# Altium schematic sheet 5  - Status Lights.SchDoc
size 406 x 304 mm
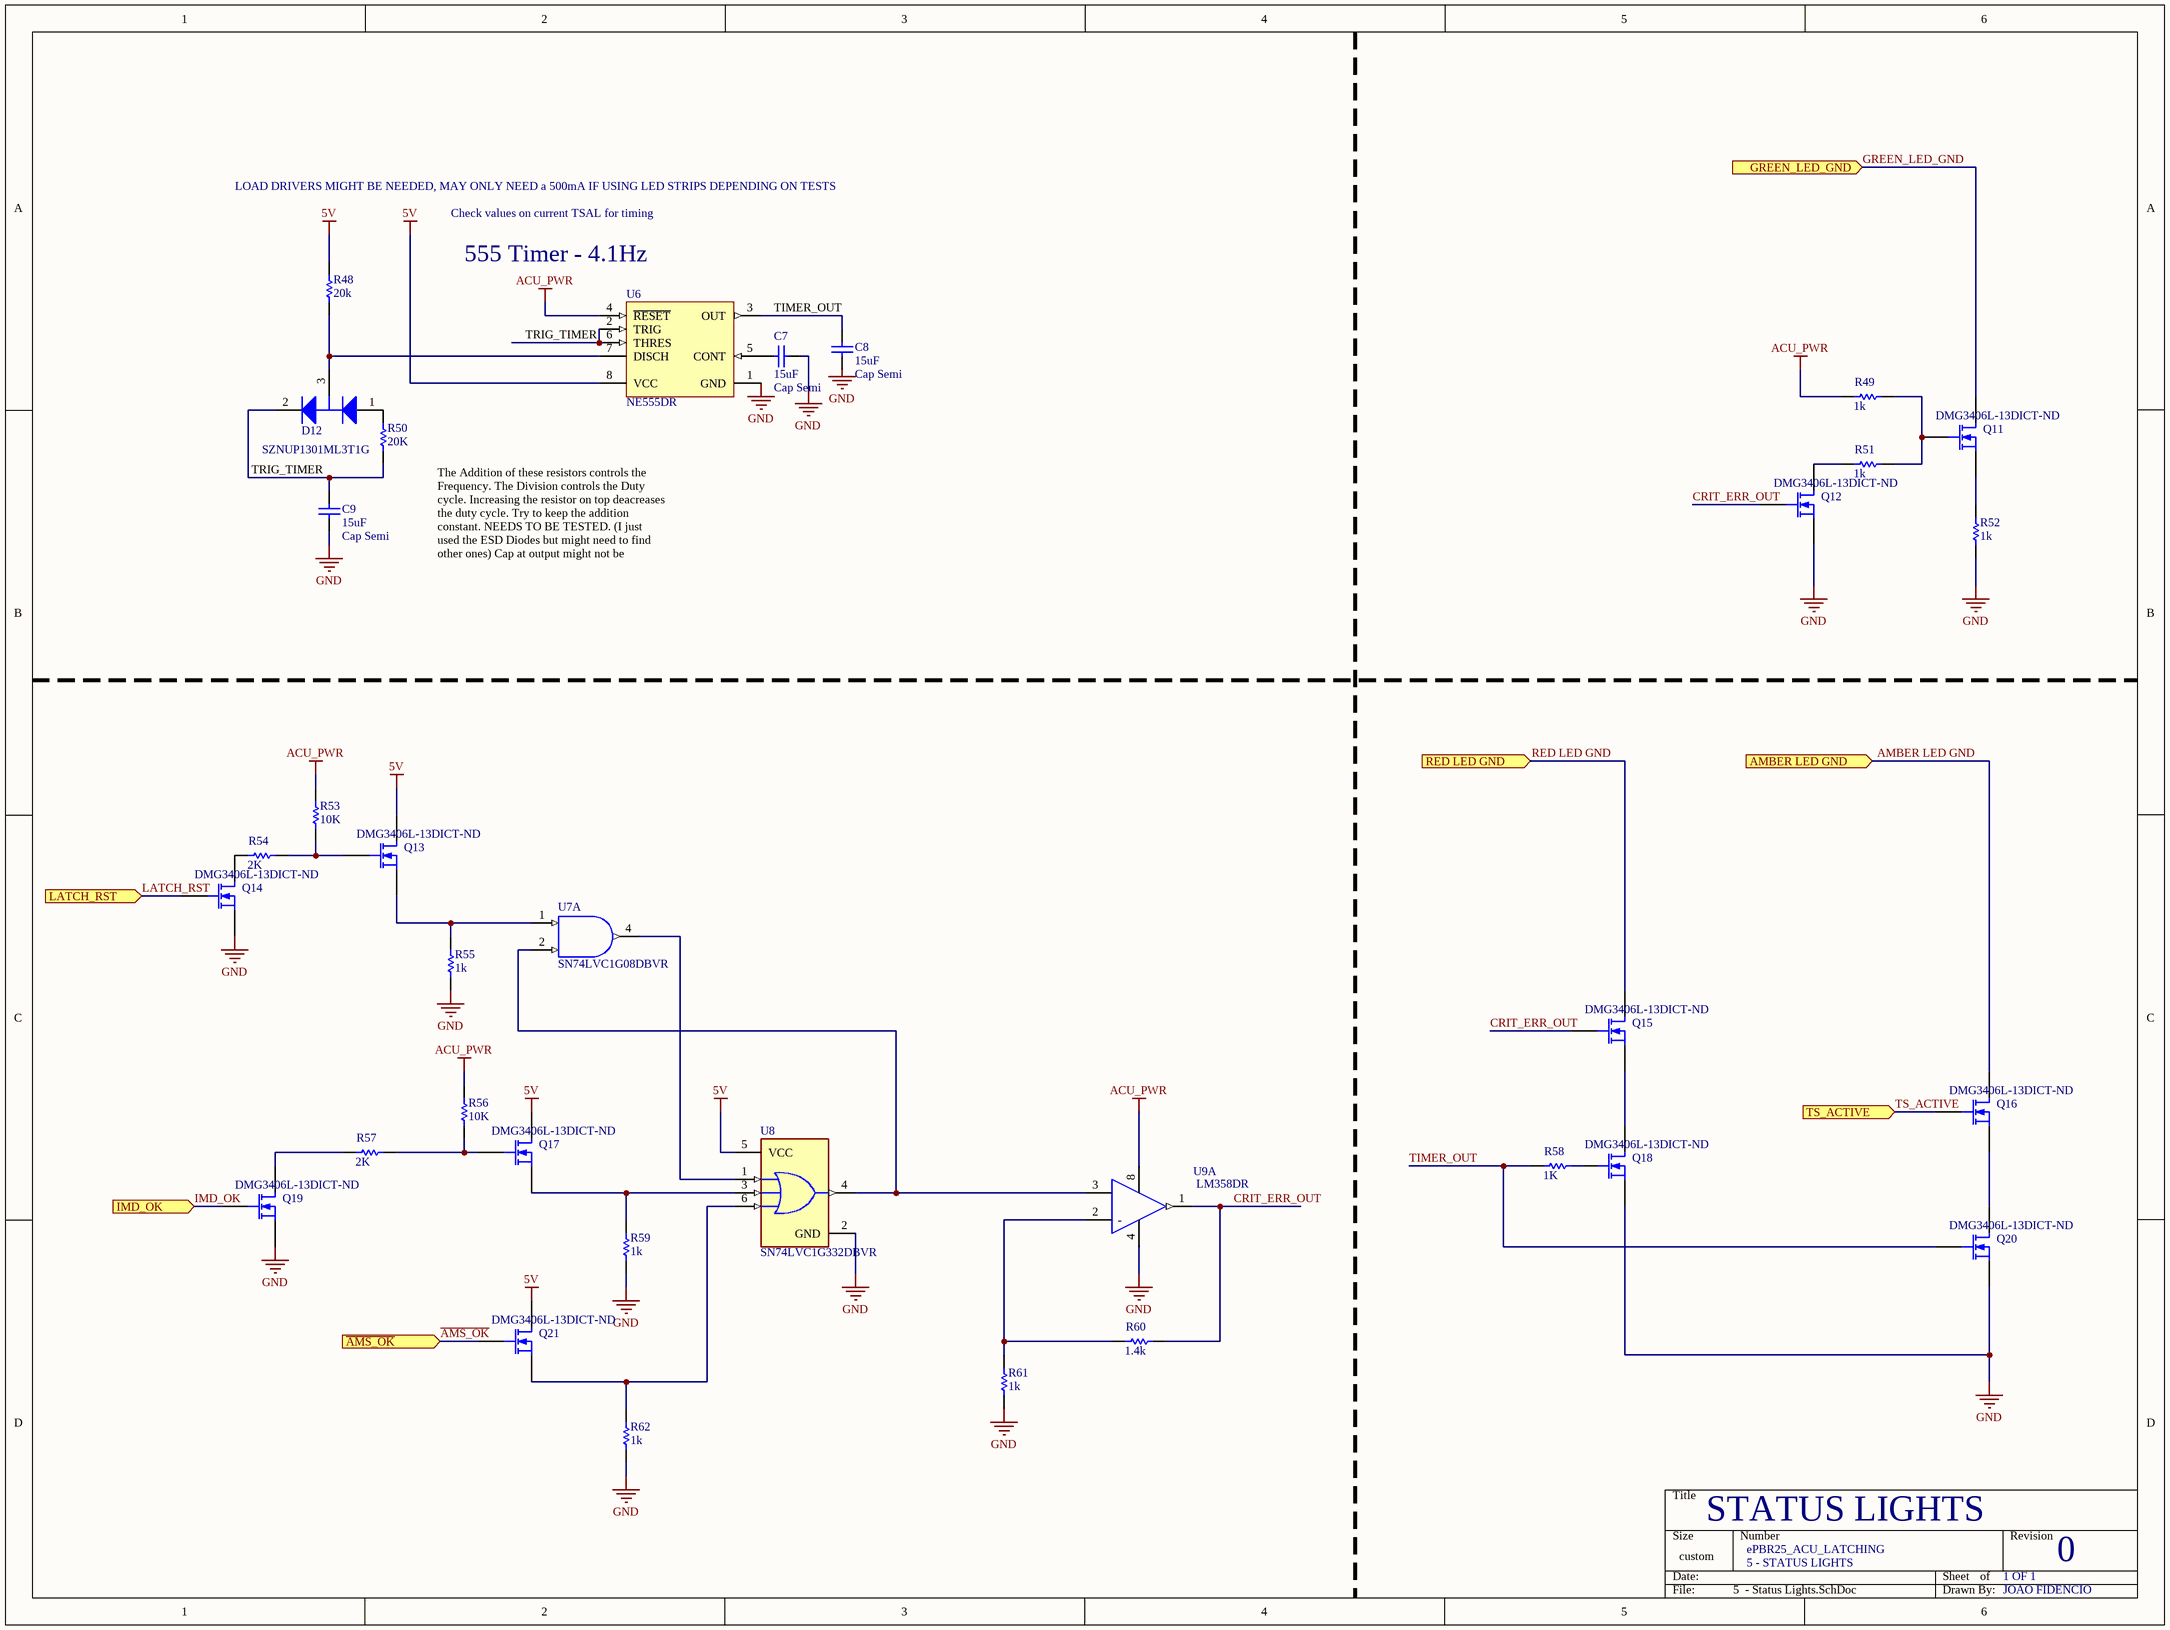
[diagram p0: 5  - Status Lights.SchDoc]

## Parts
C7  Cap Semi  value 15uF  [1608[0603]]
C8  Cap Semi  value 15uF  [1608[0603]]
C9  Cap Semi  value 15uF  [1608[0603]]
D12  SZNUP1301ML3T1G  [ONSC-SOT-23-3-318-08_V]
Q11  Supplier Part Number 1: DMG3406L-13DICT-ND  [SOT23-GDS]
Q12  Supplier Part Number 1: DMG3406L-13DICT-ND  [SOT23-GDS]
Q13  Supplier Part Number 1: DMG3406L-13DICT-ND  [SOT23-GDS]
Q14  Supplier Part Number 1: DMG3406L-13DICT-ND  [SOT23-GDS]
Q15  Supplier Part Number 1: DMG3406L-13DICT-ND  [SOT23-GDS]
Q16  Supplier Part Number 1: DMG3406L-13DICT-ND  [SOT23-GDS]
Q17  Supplier Part Number 1: DMG3406L-13DICT-ND  [SOT23-GDS]
Q18  Supplier Part Number 1: DMG3406L-13DICT-ND  [SOT23-GDS]
Q19  Supplier Part Number 1: DMG3406L-13DICT-ND  [SOT23-GDS]
Q20  Supplier Part Number 1: DMG3406L-13DICT-ND  [SOT23-GDS]
Q21  Supplier Part Number 1: DMG3406L-13DICT-ND  [SOT23-GDS]
R48  20k  [RESC0603(1608)_L]
R49  1k  [RESC0603(1608)_L]
R50  20K  [RESC0603(1608)_L]
R51  1k  [RESC0603(1608)_L]
R52  1k  [RESC0603(1608)_L]
R53  10K  [RESC0603(1608)_L]
R54  2K  [RESC0603(1608)_L]
R55  1k  [RESC0603(1608)_L]
R56  10K  [RESC0603(1608)_L]
R57  2K  [RESC0603(1608)_L]
R58  1K  [RESC0603(1608)_L]
R59  1k  [RESC0603(1608)_L]
R60  1.4k  [RESC0603(1608)_L]
R61  1k  [RESC0603(1608)_L]
R62  1k  [RESC0603(1608)_L]
U6  NE555DR  [D0008A_M]
U7  SN74LVC1G08DBVR  [DBV0005A_M]  (part A of 2)
U8  SN74LVC1G332DBVR  [FP-DBV0006A-MFG]
U9  LM358DR  [FP-D0008A-MFG]  (part A of 2)

## Ports
AMBER LED GND (in), GREEN_LED_GND (in), IMD_OK (in), LATCH_RST (in), RED LED GND (in), TS_ACTIVE (in), ~{AMS_OK} (in)

## Nets
5V: Q13.3(D) Q17.3(D) Q21.3(D) R48.1 U6.8(VCC) U8.5(VCC)
ACU_PWR: R49.1 R53.2 R56.2 U6.4(~{RESET}) U9.8(V+)
GND: C7.1 C9.2 Q12.2(S) Q14.2(S) Q18.2(S) Q19.2(S) Q20.2(S) R52.1 R55.2 R59.2 R61.2 R62.2 U6.1(GND) U8.2(GND) U9.4(V-)
~{AMS_OK}: Q21.1(G) ; port ~{AMS_OK}
AMBER LED GND: Q16.3(D) ; port AMBER LED GND
CRIT_ERR_OUT: Q12.1(G) Q15.1(G) R60.2 U9.1(1OUT)
GREEN_LED_GND: Q11.3(D) ; port GREEN_LED_GND
IMD_OK: Q19.1(G) ; port IMD_OK
LATCH_RST: Q14.1(G) ; port LATCH_RST
RED LED GND: Q15.3(D) ; port RED LED GND
TIMER_OUT: C8.1 Q20.1(G) R58.1 U6.3(OUT)
TRIG_TIMER: C9.1 D12.2(K) R50.1 U6.2(TRIG) U6.6(THRES)
TS_ACTIVE: Q16.1(G) ; port TS_ACTIVE
NetC7_2: C7.2 U6.5(CONT)
NetD12_1: D12.1(A) R50.2
NetD12_3: D12.3(K/A) R48.2 U6.7(DISCH)
NetQ11_1: Q11.1(G) R49.2 R51.2
NetQ11_2: Q11.2(S) R52.2
NetQ12_3: Q12.3(D) R51.1
NetQ13_1: Q13.1(G) R53.1 R54.2
NetQ13_2: Q13.2(S) R55.1 U7.1(A)
NetQ14_3: Q14.3(D) R54.1
NetQ15_2: Q15.2(S) Q18.3(D)
NetQ16_2: Q16.2(S) Q20.3(D)
NetQ17_1: Q17.1(G) R56.1 R57.2
NetQ17_2: Q17.2(S) R59.1 U8.3(B)
NetQ18_1: Q18.1(G) R58.2
NetQ19_3: Q19.3(D) R57.1
NetQ21_2: Q21.2(S) R62.1 U8.6(C)
NetR60_1: R60.1 R61.1 U9.2(IN1-)
NetU7_2: U7.2(B) U8.4(Y) U9.3(IN1+)
NetU7_4: U7.4(Y) U8.1(A)

Not connected (* = marked no-connect by the designer): C8 2

## Notes on the sheet
- LOAD DRIVERS MIGHT BE NEEDED, MAY ONLY NEED a 500mA IF USING LED STRIPS DEPENDING ON TESTS
- Check values on current TSAL for timing
- (near U6) 555 Timer - 4.1Hz
- The Addition of these resistors controls the Frequency. The Division controls the Duty cycle. Increasing the resistor on top deacreases the duty cycle. Try to keep the addition constant. NEEDS TO BE TESTED. (I just used the ESD Diodes but might need to find other ones) Cap at output might not be needed? Cap from 12V to GND might be needed.
- STATUS LIGHTS
- ePBR25_ACU_LATCHING
- 5 - STATUS LIGHTS
- 1 OF 1
- 0
- JOAO FIDENCIO
- Labels drawn without touching a wire or pin: GND
- (in symbol CMP-1685-00009-2, part A) -

## Library data of the parts
C7-C9 = Cap Semi: Capacitor (Semiconductor SIM Model); Published: 8-Jun-2000; LatestRevisionDate: 29-May-2009; LatestRevisionNote: IPC-7351 Footprint Added.; PackageReference: C1206; Publisher: Altium Limited; PackageDescription: Chip Capacitor
D12 = CMP-1063-00171-1: Low Capacitance Diode Array for ESD Protection in a Single Data Line, 3-Pin SOT-23, Pb-Free, Tape and Reel; Manufacturer: On Semiconductor; C Max (pF): 0.9; Direction: Bidirectional; V(BR) Min (V): 70; Number of Lines: 1; Mounting Technology: Surface Mount; PackageReference: SOT-23-3-318-08; DatasheetVersion: Rev. 6; PackageVersion: Rev. AP, 11/2009; RoHS: Pb-Free; ComponentLink1Description: Manufacturer URL; ComponentLink1URL: http://www.onsemi.com/; PackageDescription: 3-Pin Small Outline Transistor, Body 2.92 x 1.3 mm, Pitch 0.95 mm; PartNumber: SZNUP1301ML3T1G; Packing: Tape and Reel; ComponentLink3URL: http://www.onsemi.cn/pub_link/Collateral/318-08.PDF; ComponentLink3Description: Package Specification; VRWM Max (V): 70; ComponentLink2Description: Datasheet; ComponentLink2URL: http://www.onsemi.cn/pub_link/Collateral/NUP1301ML3T1-D.PDF; Supplier 1: Digi-Key; Supplier Part Number 1: SZNUP1301ML3T1GOSCT-ND
Q11-Q21 = MOSFET-N: N-Channel MOSFET; Manufacturer: Infineon Technologies; FET Type: MOSFET N-Channel, Metal Oxide; FET Feature: Logic Level Gate; Drain to Source Voltage (Vdss): 30V; Current - Continuous Drain (Id) @ 25°C: 50A (Tc); Rds On (Max) @ Id, Vgs: 7.5 mOhm @ 30A, 10V; Vgs(th) (Max) @ Id: 2.2V @ 250µA; Gate Charge (Qg) @ Vgs: 18nC @ 10V; Input Capacitance (Ciss) @ Vds: 1900pF @ 15V; Power - Max: 47W; Published: 8-Jun-2000; LatestRevisionDate: 17-Jul-2002; LatestRevisionNote: Re-released for DXP Platform.; PackageVersion: 1995/1996; PackageReference: E3; Publisher: Altium Limited; PackageDescription: TO, Flat Index; 3 In-Line, Axial Leads; Body Dia. 4.6mm; Lead Dia. 0.5 mm (max); RoHS: RoHS Compliant; Category: Discrete Semiconductor Products; Packaging: Cut Tape (CT); Mounting Type: Surface Mount; Package / Case: TO-252-3, DPak (2 Leads + Tab), SC-63; Supplier Device Package: PG-TO252-3; ComponentLink1URL: http://www.infineon.com/dgdl/Infineon-IPD075N03LG-DS-v02_01-en.pdf?folderId=5546d4694909da4801490a07012f053b&fileId=db3a30431936bc4b011951d824f83aeb; ComponentLink1Description: http://www.infineon.com/dgdl/Infineon-IPD075N03LG-DS-v02_01-en.pdf?folderId=5546d4694909da4801490a07012f053b&fileId=db3a30431936bc4b011951d824f83aeb; ComponentLink2URL: http://www.semicon.toshiba.co.jp/info/docget.jsp?type=datasheet&lang=en&pid=SSM3K329R; ComponentLink2Description: http://www.semicon.toshiba.co.jp/info/docget.jsp?type=datasheet&lang=en&pid=SSM3K329R; Supplier 1: Digi-Key
R48 R50 R53 R54 R56 R57 R60 = CMP-1591-00001-1: 0603 (1608 Metric) Chip Resistor; Value: 1k; Case-Metric: 1608; Case-EIA: 0603; PackageReference: RESC0603(1608); Supplier 1: Digi-Key
  R48: Supplier Part Number 1: 311-10KGRCT-ND
  R50: Supplier Part Number 1: 311-27KGRCT-ND
  R53 R54 R56 R57 R60: Supplier Part Number 1: 311-1.0KGRCT-ND
R49 R51 R52 R55 R58 R59 R61 R62 = CMP-1591-00001-1: 0603 (1608 Metric) Chip Resistor; Case-Metric: 1608; Case-EIA: 0603; Value: 1k; PackageReference: RESC0603(1608); Supplier 1: Digi-Key; Supplier Part Number 1: 311-1.0KGRCT-ND
U6 = CMP-1685-00007-1: Precision Timer, 4.5 to 16 V, 0 to 70 degC, 8-Pin SOIC (D8), Green (RoHS & no Sb/Br), Tape and Reel; Forward Voltage: 450 mV; Forward Current: 1 A; Max Surge Current: 30 A; Peak Reverse Current: 500 uA; Case\Package: SMA; PackageReference: D0008A; Width: 2.84 mm; PackageDescription: 8-Pin Small Outline Integrated Circuit, Body 4.9 x 3.9 mm, Pitch 1.27 mm; DatasheetVersion: SLFS022I, 09/2014; ComponentLink2Description: Datasheet; Package Quantity: 1; REACH SVHC: Unknown; Radiation Hardening: No; Height: 2.44 mm; Code_JEDEC: MS-012; Pins: 2; ComponentLink1Description: Manufacturer URL; ComponentLink3Description: Package Specification; ComponentLink3URL: http://www.ti.com/lit/ml/msoi002j/msoi002j.pdf; Length: 4.57 mm; ComponentLink1URL: http://www.ti.com/; Mount: Surface Mount; PackageVersion: 4040047-3/M, 06/2011; ComponentLink2URL: http://www.ti.com/general/docs/lit/getliterature.tsp?genericPartNumber=NE555&fileType=pdf; RoHSCompliant: true; Max Operating Temperature: 125 degC; Packaging: Cut Tape; Min Operating Temperature: -55 degC; Supplier 1: Digi-Key; Supplier Part Number 1: 296-6501-2-ND
U7 = CMP-0859-00053-3: Single 2-Input Positive-AND Gate, DBV0005A, LARGE T&R; Manufacturer: Texas Instruments; Logic: True; ICC @ Nom Voltage(Max)(mA): 0.01; VCC(Min)(V): 1.65; Bits(#): 1; Rating: Catalog; Schmitt Trigger: No; Voltage(Nom)(V): 1.8,2.5,3.3,5; Output Drive (IOL/IOH)(Max)(mA): 32/-32; Gate Type: AND; tpd @ Nom Voltage(Max)(ns): 4.5,6,4,5; VCC(Max)(V): 5.5; Output Type: CMOS; F @ Nom Voltage(Max)(Mhz): 150; Input Type: CMOS/TTL; Technology Family: LVC; Sub-Family: AND Gate; PackageReference: DBV0005A; Generic Part Number: SN74LVC1G08; Operating Temperature Range(C): -40 to 125,-40 to 85; 3-State Output: No; DatasheetVersion: SCES217Y
U8 = CMP-0859-00188-4: IC GATE OR 1CH 3-INP SOT23-6; Manufacturer: TEXAS INSTRUMENTS; Number Of Inputs: 3; Nominal Supply Current: 10-500uA; Number Of Circuits: 1; Max Supply Voltage: 5.5V; Standoff Height: 0mm; Propagation Delay: 4.5ns; Min Supply Voltage: 1.5V; Height: 1.45mm; Temperature Range High: +125°C; Device Class L3: Logic Gates; Device Class L2: Logic ICs; Lead Free: Yes; Temperature Range Low: -40°C; ComponentLink2URL: http://www.ti.com/lit/ds/symlink/sn74lvc1g332.pdf; Package: DBV0006A; ComponentLink2Description: Datasheet; Octopart: https://octopart.com/sn74lvc1g332dbvr-texas+instruments-464996; Category: IC; Automotive: No; Manufacturer Part Number: SN74LVC1G332DBVR; Ipc Land Pattern Name: SOT95P280X145-6; Logic Function Desc: OR; Ambient Temperature Range Low: -40°C; Temperature: -40°C to +125°C; Number Of Outputs: 1; Mouser Description: Logic Gates Sngl 3 Inpt + OR Gt; RoHS: TRUE; Ambient Temperature Range High: +125°C; Device Class L1: Integrated Circuits (ICs); Digikey Description: IC GATE OR 1CH 3-INP SOT23-6
U9 = CMP-1685-00009-2: IC OPAMP GP 2 CIRCUIT 8SOIC; Output Current: 30mA; Min Dual Supply Voltage: 1.5V; Input Offset Voltage (Vos): 7mV; Power Supply Rejection Ratio (PSRR): 65dB; Unity Gain Bandwidth Product: 700kHz; Number of Channels: 2; Min Supply Voltage: 3V; Max Dual Supply Voltage: 16V; Dual Supply Voltage: 9V; Max Supply Voltage: 32V; Nominal Supply Current: 1.2mA; Slew Rate: 0.3V/µs; Input Bias Current: 250nA; Voltage Gain: 100dB; Operating Supply Current: 1mA; REACH SVHC: No SVHC; Package Quantity: 2500; Width: 3.91mm; Max Operating Temperature: 70°C; Min Operating Temperature: 0°C; Mount: Surface Mount; Length: 4.9mm; Radiation Hardening: No; Case/Package: SOIC; Lead Free: Lead Free; Number of Elements: 2; Packaging: Tape and Reel; Output Current per Channel: 30mA; Number of Circuits: 2; Bandwidth: 700kHz; Operating Supply Voltage: 16V; Gain Bandwidth Product: 700kHz; Number of Pins: 8; Number of Amplifiers: 2; Height: 1.58mm; Common Mode Rejection Ratio: 65dB; Contact Plating: Gold